# EAGLE schematic Updated_ADC (EAGLE 9.1.3)
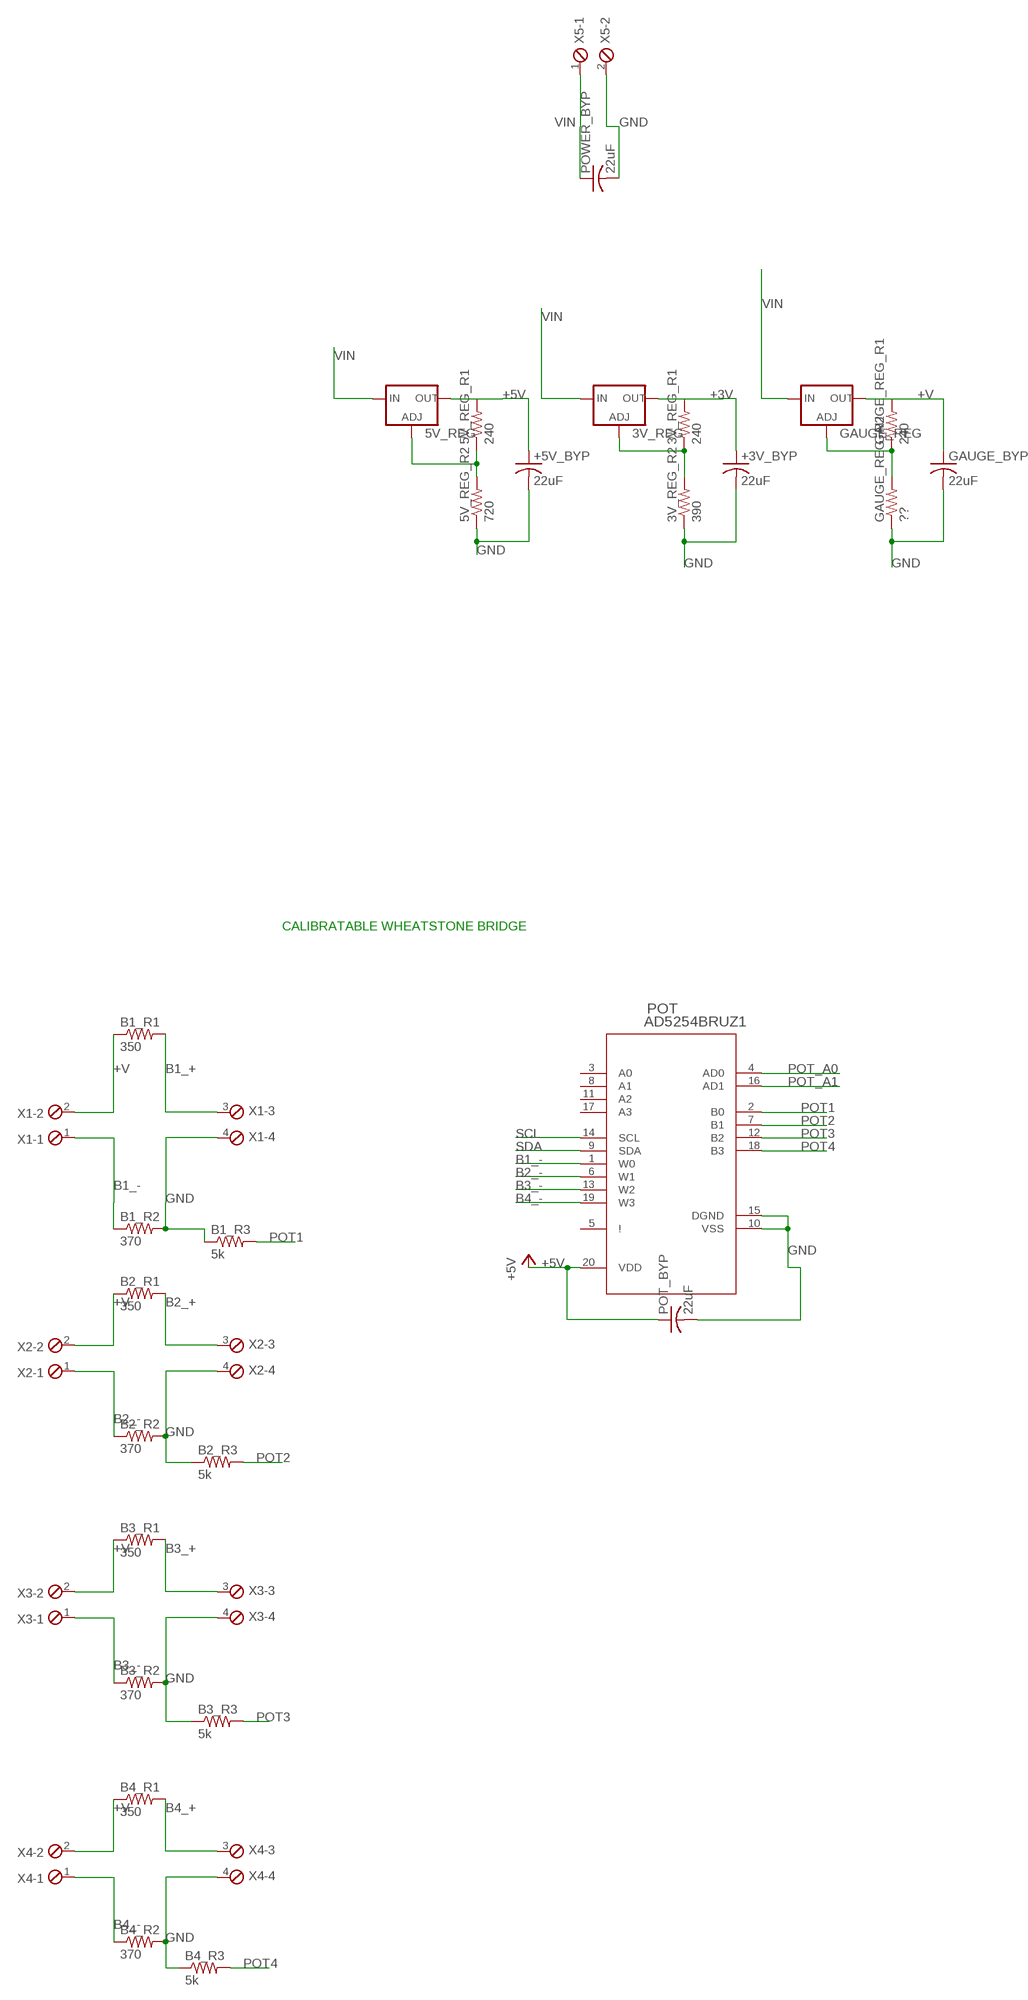
[diagram p0: schematic, sheet 1, part 1 of 2]
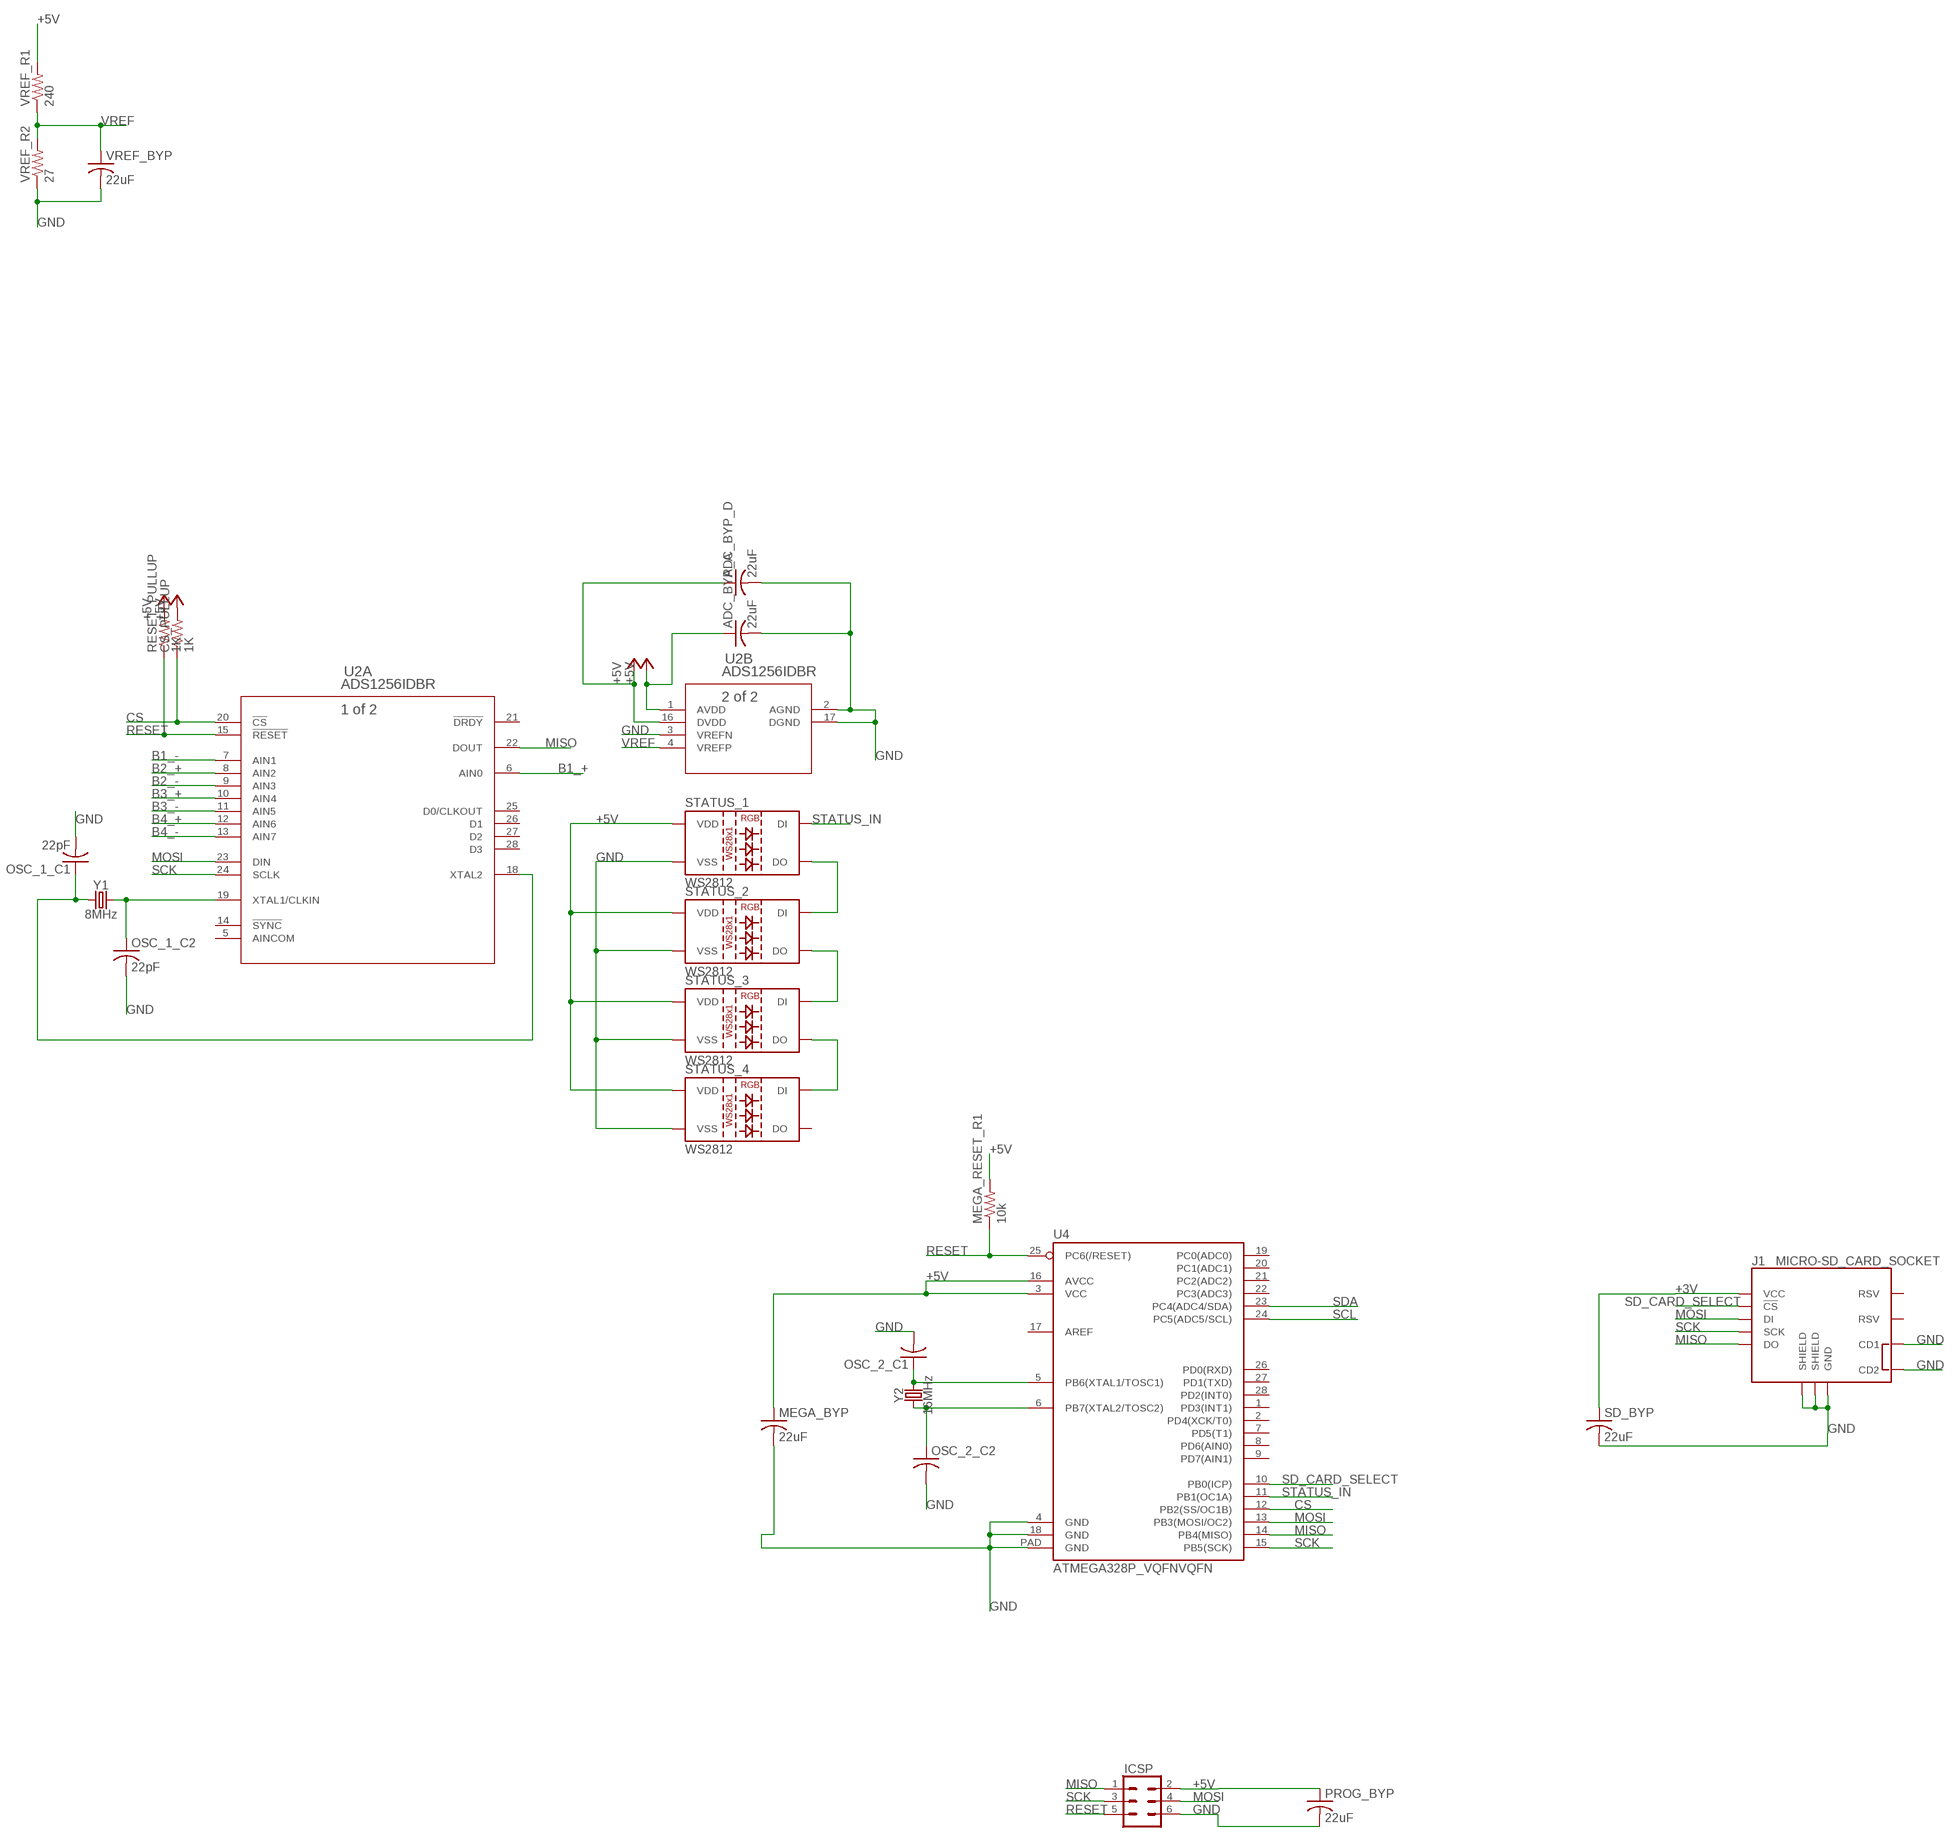
[diagram p1: schematic, sheet 1, part 2 of 2]

## Parts
3V_REG  V_REG_317SMD  [SOT223]
3V_REG_R1  240  R-US_R1206  [R1206]
3V_REG_R2  390  R-US_R1206  [R1206]
5V_REG  V_REG_317SMD  [SOT223]
5V_REG_R1  240  R-US_R1206  [R1206]
5V_REG_R2  720  R-US_R1206  [R1206]
+3V_BYP  22uF  C-USC1206  [C1206]
+5V_BYP  22uF  C-USC1206  [C1206]
ADC_BYP_A  22uF  C-USC1206  [C1206]
ADC_BYP_D  22uF  C-USC1206  [C1206]
B1_R1  350  R-US_R1206  [R1206]
B1_R2  370  R-US_R1206  [R1206]
B1_R3  5k  R-US_R1206  [R1206]
B2_R1  350  R-US_R1206  [R1206]
B2_R2  370  R-US_R1206  [R1206]
B2_R3  5k  R-US_R1206  [R1206]
B3_R1  350  R-US_R1206  [R1206]
B3_R2  370  R-US_R1206  [R1206]
B3_R3  5k  R-US_R1206  [R1206]
B4_R1  350  R-US_R1206  [R1206]
B4_R2  370  R-US_R1206  [R1206]
B4_R3  5k  R-US_R1206  [R1206]
CS_PULLUP  1K  R-US_M1206  [M1206]
GAUGE_BYP  22uF  C-USC1206  [C1206]
GAUGE_REG  V_REG_317SMD  [SOT223]
GAUGE_REG_R1  240  R-US_R1206  [R1206]
GAUGE_REG_R2  ??  R-US_R1206  [R1206]
ICSP  CONN_03X2FEMALE  [2X3]
J1  MICRO-SD_CARD_SOCKET  [MICRO-SD-SOCKET]
MEGA_BYP  22uF  C-USC1206  [C1206]
MEGA_RESET_R1  10k  R-US_M1206  [M1206]
OSC_1_C1  22pF  C-USC1206  [C1206]
OSC_1_C2  22pF  C-USC1206  [C1206]
OSC_2_C1  C-USC1206  [C1206]
OSC_2_C2  C-USC1206  [C1206]
POT  AD5254BRUZ1  [RU_20]
POT_BYP  22uF  C-USC1206  [C1206]
POWER_BYP  22uF  C-USC1206  [C1206]
PROG_BYP  22uF  C-USC1206  [C1206]
RESET_PULLUP  1K  R-US_M1206  [M1206]
SD_BYP  22uF  C-USC1206  [C1206]
STATUS_1  WS2812  WS2812"  [LED-TRICOLOR-5050-IC]
STATUS_2  WS2812  WS2812"  [LED-TRICOLOR-5050-IC]
STATUS_3  WS2812  WS2812"  [LED-TRICOLOR-5050-IC]
STATUS_4  WS2812  WS2812"  [LED-TRICOLOR-5050-IC]
U2  ADS1256IDBR  [DB28]
U4  ATMEGA328P_VQFNVQFN  [VQFN-28]
VREF_BYP  22uF  C-USC1206  [C1206]
VREF_R1  240  R-US_R1206  [R1206]
VREF_R2  27  R-US_R1206  [R1206]
X1  MPT4  [4POL254]
X2  MPT4  [4POL254]
X3  MPT4  [4POL254]
X4  MPT4  [4POL254]
X5  MPT2  [2POL254]
Y1  8MHz  CRYSTAL-8MHZSMD-5X3.2  [CRYSTAL-SMD-5X3.2-4PAD]
Y2  16MHz  CRYSTAL-8MHZSMD-5X3.2  [CRYSTAL-SMD-5X3.2-4PAD]

## Nets
+3V: 3V_REG.2(OUT) +3V_BYP.1 J1.VCC SD_BYP.1
+5V: 5V_REG.2(OUT) +5V_BYP.1 ADC_BYP_A.1 ADC_BYP_D.1 CS_PULLUP.2 ICSP.2 MEGA_BYP.1 MEGA_RESET_R1.2 POT.20(VDD) POT_BYP.1 PROG_BYP.1 RESET_PULLUP.2 STATUS_1.3(VDD) STATUS_1.5(VDD) STATUS_2.3(VDD) STATUS_2.5(VDD) STATUS_3.3(VDD) STATUS_3.5(VDD) STATUS_4.3(VDD) STATUS_4.5(VDD) U2.1(B:AVDD) U2.16(B:DVDD) U4.3(VCC) U4.16(AVCC) VREF_R1.2
+V: B1_R1.1 B2_R1.1 B3_R1.1 B4_R1.1 GAUGE_BYP.1 GAUGE_REG.2(OUT) X1.2 X2.2 X3.2 X4.2
B1_+: B1_R1.2 U2.6(A:AIN0) X1.3
B1_-: B1_R2.1 POT.1(W0) U2.7(A:AIN1) X1.1
B2_+: B2_R1.2 U2.8(A:AIN2) X2.3
B2_-: B2_R2.1 POT.6(W1) U2.9(A:AIN3) X2.1
B3_+: B3_R1.2 U2.10(A:AIN4) X3.3
B3_-: B3_R2.1 POT.13(W2) U2.11(A:AIN5) X3.1
B4_+: B4_R1.2 U2.12(A:AIN6) X4.3
B4_-: B4_R2.1 POT.19(W3) U2.13(A:AIN7) X4.1
CS: CS_PULLUP.1 U2.20(A:!CS) U4.12(PB2(SS/OC1B))
GND: 3V_REG_R2.1 5V_REG_R2.1 +3V_BYP.2 +5V_BYP.2 ADC_BYP_A.2 ADC_BYP_D.2 B1_R2.2 B1_R3.1 B2_R2.2 B2_R3.1 B3_R2.2 B3_R3.1 B4_R2.2 B4_R3.1 GAUGE_BYP.2 GAUGE_REG_R2.1 ICSP.6 J1.CD1 J1.CD2 J1.GND J1.GND1(SHIELD) J1.GND3(SHIELD) MEGA_BYP.2 OSC_1_C1.2 OSC_1_C2.2 OSC_2_C1.2 OSC_2_C2.2 POT.10(VSS) POT.15(DGND) POT_BYP.2 POWER_BYP.2 PROG_BYP.2 SD_BYP.2 STATUS_1.6(VSS) STATUS_2.6(VSS) STATUS_3.6(VSS) STATUS_4.6(VSS) U2.2(B:AGND) U2.3(B:VREFN) U2.17(B:DGND) U4.4(GND) U4.18(GND) U4.PAD(GND) VREF_BYP.2 VREF_R2.1 X1.4 X2.4 X3.4 X4.4 X5.2
MISO: ICSP.1 J1.DO U2.22(A:DOUT) U4.14(PB4(MISO))
MOSI: ICSP.4 J1.DI U2.23(A:DIN) U4.13(PB3(MOSI/OC2))
N$2: OSC_1_C2.1 U2.19(A:XTAL1/CLKIN) Y1.3
N$3: OSC_1_C1.1 U2.18(A:XTAL2) Y1.1
N$4: OSC_2_C1.1 U4.5(PB6(XTAL1/TOSC1)) Y2.3
N$5: OSC_2_C2.1 U4.6(PB7(XTAL2/TOSC2)) Y2.1
N$8: 5V_REG.1(ADJ) 5V_REG_R1.1 5V_REG_R2.2
N$12: 3V_REG.1(ADJ) 3V_REG_R1.1 3V_REG_R2.2
N$14: STATUS_1.1(DO) STATUS_2.2(DI)
N$15: STATUS_2.1(DO) STATUS_3.2(DI)
N$16: STATUS_3.1(DO) STATUS_4.2(DI)
N$20: GAUGE_REG.1(ADJ) GAUGE_REG_R1.1 GAUGE_REG_R2.2
POT1: B1_R3.2 POT.2(B0)
POT2: B2_R3.2 POT.7(B1)
POT3: B3_R3.2 POT.12(B2)
POT4: B4_R3.2 POT.18(B3)
POT_A0: POT.4(AD0)
POT_A1: POT.16(AD1)
RESET: ICSP.5 MEGA_RESET_R1.1 RESET_PULLUP.1 U2.15(A:!RESET) U4.25(PC6(/RESET))
SCK: ICSP.3 J1.SCLK(SCK) U2.24(A:SCLK) U4.15(PB5(SCK))
SCL: POT.14(SCL) U4.24(PC5(ADC5/SCL))
SD_CARD_SELECT: J1.CS(!CS) U4.10(PB0(ICP))
SDA: POT.9(SDA) U4.23(PC4(ADC4/SDA))
STATUS_IN: STATUS_1.2(DI) U4.11(PB1(OC1A))
VIN: 3V_REG.3(IN) 5V_REG.3(IN) GAUGE_REG.3(IN) POWER_BYP.1 X5.1
VREF: U2.4(B:VREFP) VREF_BYP.1 VREF_R1.1 VREF_R2.2
Unconnected: 3V_REG_R1.2 5V_REG_R1.2 GAUGE_REG_R1.2 J1.RSV1(RSV) J1.RSV2(RSV) POT.3(A0) POT.5(!) POT.8(A1) POT.11(A2) POT.17(A3) STATUS_4.1(DO) U2.5(A:AINCOM) U2.14(A:!SYNC) U2.21(A:!DRDY) U2.25(A:D0/CLKOUT) U2.26(A:D1) U2.27(A:D2) U2.28(A:D3) U4.1(PD3(INT1)) U4.2(PD4(XCK/T0)) U4.7(PD5(T1)) U4.8(PD6(AIN0)) U4.9(PD7(AIN1)) U4.17(AREF) U4.19(PC0(ADC0)) U4.20(PC1(ADC1)) U4.21(PC2(ADC2)) U4.22(PC3(ADC3)) U4.26(PD0(RXD)) U4.27(PD1(TXD)) U4.28(PD2(INT0))

## Notes on the sheet
- CALIBRATABLE WHEATSTONE BRIDGE

## Library data of the parts
3V_REG 5V_REG GAUGE_REG = SparkFun-IC-Power:V_REG_317: Voltage Regulator Standard LM317 adjustable voltage regulator. AOI (Adjust Output Input). Google 'LM317 Calculator' for easy to use app to get the two resistor values needed. 240/720 for 5V output. 240/390 for 3.3V output. Spark Fun Electronics SKU : COM-00527
3V_REG_R1 3V_REG_R2 5V_REG_R1 5V_REG_R2 GAUGE_REG_R1 GAUGE_REG_R2 = rcl:R-US_: RESISTOR, American symbol; SPICEPREFIX: R
+3V_BYP +5V_BYP ADC_BYP_A ADC_BYP_D GAUGE_BYP MEGA_BYP OSC_1_C1 OSC_1_C2 OSC_2_C1 OSC_2_C2 POT_BYP POWER_BYP PROG_BYP SD_BYP VREF_BYP = resistor:C-US: CAPACITOR, American symbol
B1_R1-B1_R3 B2_R1-B2_R3 B3_R1-B3_R3 B4_R1-B4_R3 CS_PULLUP MEGA_RESET_R1 RESET_PULLUP VREF_R1 VREF_R2 = resistor:R-US_: RESISTOR, American symbol
ICSP = SparkFun-Connectors:CONN_03X2: Multi connection point. Often used as Generic Header-pin footprint for 0.1 inch spaced/style header connections You can populate with any combo of single row headers, but if you'd like an exact match, check these: Header - 2x3 (Male, 0.1") <https://www.sparkfun.com/products/12807> (PRT-12807) Header - 2x3 (Female, 0.1") <https://www.sparkfun.com/products/13010> (PRT-13010) 2x3 Pin Shrouded Header <https://www.sparkfun.com/products/10877> (PRT-10877) On any of the 0.1 inch spaced packages, you can populate with these: Break Away Headers - Straight <https://www.sparkfun.com/products/116> (PRT-00116) Break Away Male Headers - Right Angle <https://www.sparkfun.com/products/553> (PRT-00553) Female Headers <https://www.sparkfun.com/products/115> (PRT-00115) Break Away Headers - Machine Pin <https://www.sparkfun.com/products/117> (PRT-00117) Break Away Female Headers - Swiss Machine Pin <https://www.sparkfun.com/products/743> (PRT-00743) Special note: the shrouded connector mates well with our 3x2 ribbon cables: Ribbon Crimp Connector - 6-pin (2x3, Female) <https://www.sparkfun.com/products/10651> (PRT-10651) Ribbon Cable - 6 wire (15ft) <https://www.sparkfun.com/products/10646> (PRT-10646); PROD_ID: CONN-11566; VALUE: FEMALE 2x3
J1 = SparkFun-Connectors:MICRO-SD_CARD_SOCKET: microSD Socket for Transflash Push-push type µSD socket. tDoc lines correctly indicate media card edge positions when inserting (unlocked, locked, depressed). NOTE: CD1 and CD2 are connected internally, and the default detect state of the socket is detect pin to ground. SparkFun Products: WAV Trigger <https://www.sparkfun.com/products/13660> CAN-Bus Shield <https://www.sparkfun.com/products/13262> SparkFun Level Shifing microSD Breakout <https://www.sparkfun.com/products/13743>; PROD_ID: CONN-07820; SF_ID: PRT-00127
POT = AD5254 Digital Potentiometer:AD5254BRUZ1; MANUFACTURER_PART_NUMBER: AD5254BRUZ1; VENDOR: Analog Devices Inc
STATUS_1-STATUS_4 = SparkFun-LED:WS2812: WS2812 RGB LED w/ WS2811 driver 5x5mm SMD LED with built-in controller IC. Color: Red/Green/Blue mC Rating: RGB: 550, 1100, 200 mcd Current:RGB: 20, 20, 20 mA Forward Voltage: RGB: 1.8, 3.0, 3.2 V Packages:LED-TRICOLOR-5050-IC SparkFun Products: LED-SMD RGB (WS2812) <https://www.sparkfun.com/products/11821>; PROD_ID: DIO-11598
U2 = ADS1256:ADS1256IDBR; MANUFACTURER_PART_NUMBER: ADS1256IDBR; VENDOR: Texas Instruments
U4 = SparkFun-IC-Microcontroller:ATMEGA328P_VQFN: Atmel 328P QFN part not in catalog
X1-X4 = con-phoenix-254:MPT4: PHOENIX CONNECTOR; OC_FARNELL: unknown; OC_NEWARK: unknown
X5 = con-phoenix-254:MPT2: PHOENIX CONNECTOR; OC_FARNELL: unknown; OC_NEWARK: unknown
Y1 = SparkFun-Clocks:CRYSTAL-8MHZ: 8MHz Crystal Datasheet Example <http://www.futureelectronics.com/en/technologies/electromechanical/timing-devices/crystals/Pages/6008189-ABM3B-8.000MHZ-B2-T.aspx?IM=0> Frequency: 8MHz Frequency Tolerance: ±20ppm Load Capacitance: 18pF SparkFun Products: Pro Micro -3.3V/8MHz <https://www.sparkfun.com/products/12587> WAV Trigger <https://www.sparkfun.com/products/13660>; PROD_ID: XTAL-09431
Y2 = SparkFun-Clocks:CRYSTAL-8MHZ: 8MHz Crystal Datasheet Example <http://www.futureelectronics.com/en/technologies/electromechanical/timing-devices/crystals/Pages/6008189-ABM3B-8.000MHZ-B2-T.aspx?IM=0> Frequency: 8MHz Frequency Tolerance: ±20ppm Load Capacitance: 18pF SparkFun Products: Pro Micro -3.3V/8MHz <https://www.sparkfun.com/products/12587> WAV Trigger <https://www.sparkfun.com/products/13660>; PROD_ID: XTAL-09431; VALUE: 8MHz